# Altium project Phaser.PrjPCB (part 9 of 9)
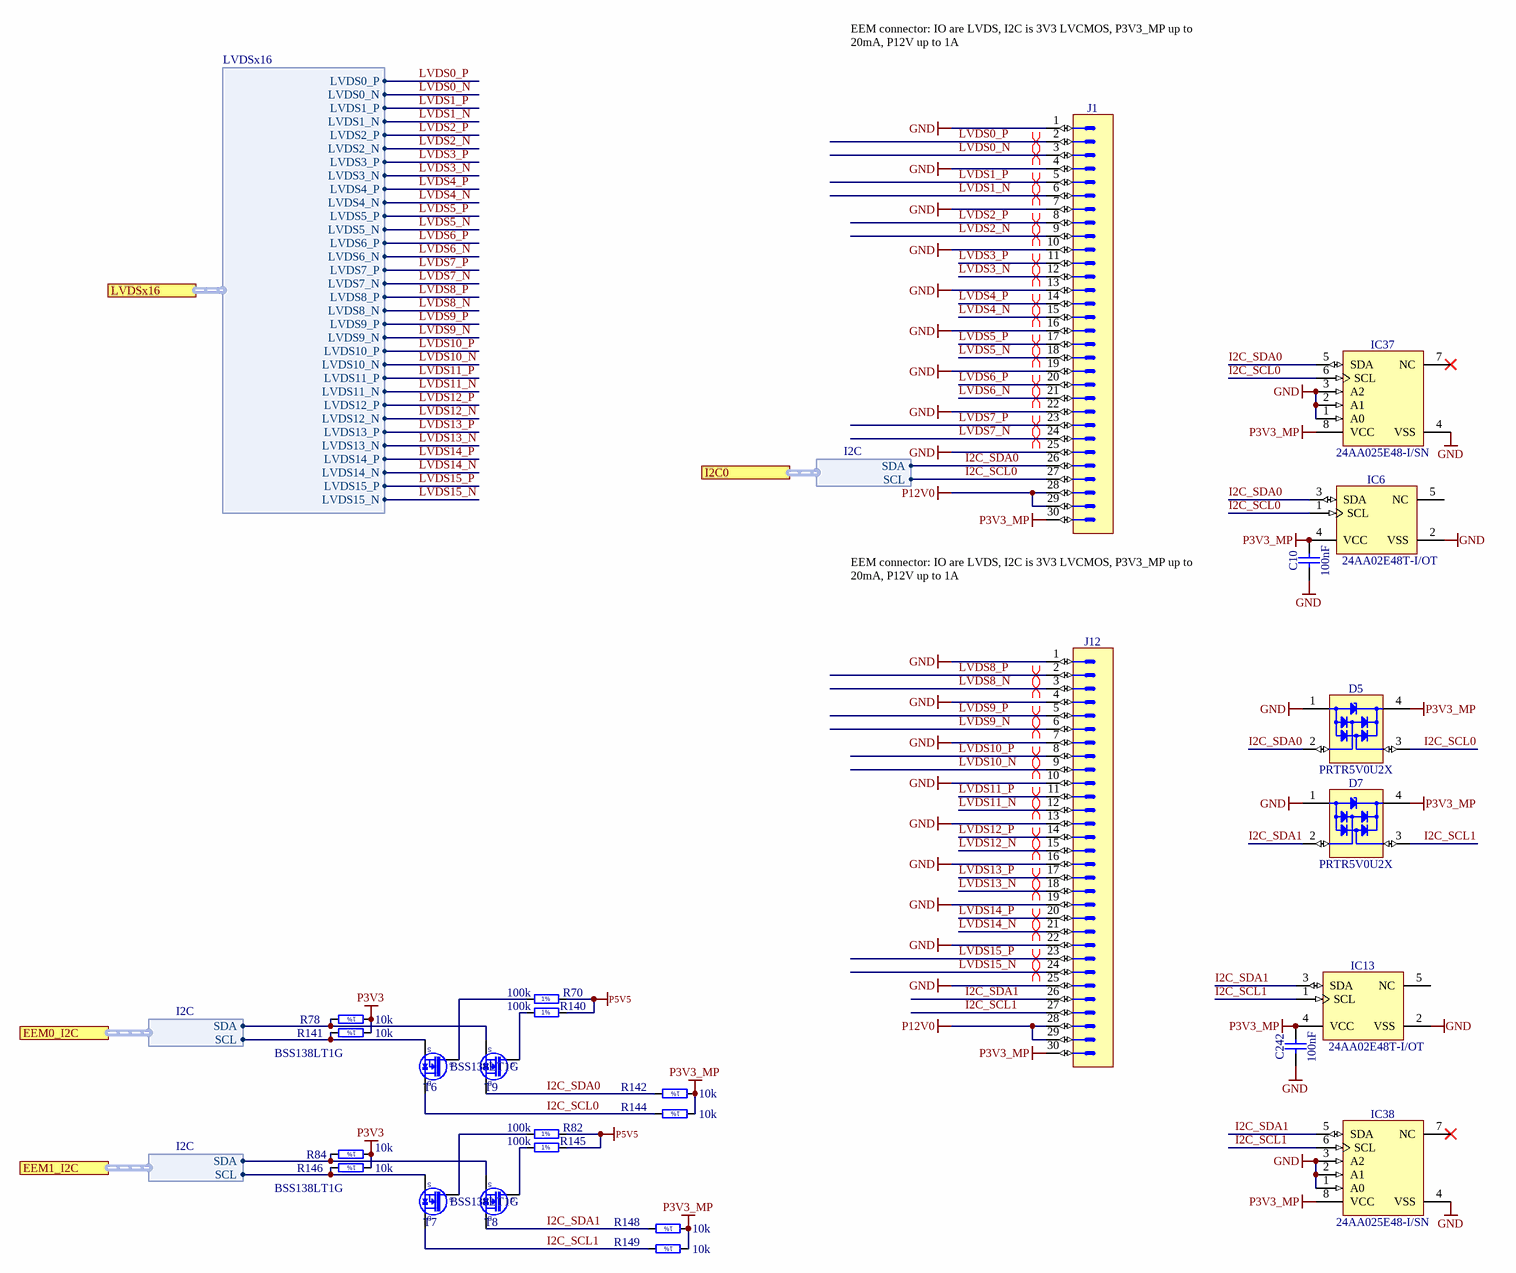
[diagram p117: LVDS_IFC.SchDoc]

## Nets that join several sheets
GND: Phaser (34 pins), Attenuator0 (28 pins), Attenuator1 (28 pins), PWR_Supply (52 pins), CLK_INPUT (7 pins), ADC_2CH (29 pins), U_Input_channel (17 pins), DAC (36 pins), FPGA_CFG_EEM (R43.1), U_Input_channel (17 pins), FPGA_SUP_CFG (181 pins), FPGA_GTP (16 pins), FPGA_SDRAM (46 pins), CFG_FLASH_Update (11 pins), U_Upconversion (53 pins), U_Upconversion (53 pins), DAC_SUPPLY (114 pins), PWR_Supply-5.5V (95 pins), LVDS_IFC (32 pins)
MGTAVTT: FPGA_SUP_CFG (14 pins), FPGA_GTP (R191.1)
N11V5A: PWR_Supply (6 pins), U_Input_channel (8 pins), U_Input_channel (8 pins)
P1V0: PWR_Supply (R182.2 TP13.1), FPGA_SUP_CFG (31 pins), PWR_Supply-5.5V (C260.2 L42.2 R131.1 R155.2)
P1V2: PWR_Supply (R183.2 TP14.1), FPGA_SUP_CFG (L18.1), PWR_Supply-5.5V (C338.2 IC28.1)
P1V2A: PWR_Supply (R205.2 TP1.1), DAC_SUPPLY (24 pins), PWR_Supply-5.5V (6 pins)
P1V2D: DAC_SUPPLY (22 pins), PWR_Supply-5.5V (6 pins)
P1V5: PWR_Supply (R208.2 TP3.1), FPGA_SUP_CFG (14 pins), FPGA_SDRAM (29 pins), PWR_Supply-5.5V (7 pins)
P1V8: PWR_Supply (R210.2 TP10.1), FPGA_SUP_CFG (C232.2 L4.1 L26.1), PWR_Supply-5.5V (C336.2 L50.2 R166.2)
P1V8A: CLK_INPUT (L10.2), PWR_Supply-5.5V (C340.2 IC35.5)
P2V5: Phaser (R235.2 R236.2), PWR_Supply (R211.2 TP4.1), ADC_2CH (C55.2 IC24.1 L8.2), FPGA_CFG_EEM (R42.2), FPGA_SUP_CFG (53 pins), FPGA_GTP (C238.2 OSC2.2 OSC2.6), CFG_FLASH_Update (10 pins), DAC_SUPPLY (L7.2), PWR_Supply-5.5V (C361.2 IC29.4)
P3V3: Phaser (R29.1 R64.1 R259.1 R260.1), PWR_Supply (5 pins), CLK_INPUT (LD7.2), DAC (R231.2), FPGA_SUP_CFG (13 pins), FPGA_SDRAM (C172.2 IC9.7 IC9.10 R127.2), CFG_FLASH_Update (IC27.2), PWR_Supply-5.5V (9 pins), LVDS_IFC (R78.1 R84.1 R141.1 R146.1)
P3V3_MP: PWR_Supply (R212.2 TP5.1), PWR_Supply-5.5V (9 pins), LVDS_IFC (14 pins)
P3V3A: PWR_Supply (R213.2 TP6.1), U_Upconversion (7 pins), U_Upconversion (7 pins), DAC_SUPPLY (L14.2 L17.2 L41.2), PWR_Supply-5.5V (6 pins)
P3V6: PWR_Supply (R215.2 TP15.1), PWR_Supply-5.5V (C348.2 L48.2 L51.1 R200.2)
P5V0A: Attenuator0 (L16A.1), Attenuator1 (L16B.1), PWR_Supply (R216.2 TP16.1), ADC_2CH (8 pins), U_Upconversion (L34A.1 L35A.2), U_Upconversion (L34B.1 L35B.2), PWR_Supply-5.5V (C155.2 C266.2 IC21.4 R130.2)
P5V5: PWR_Supply (R217.2 TP8.1), PWR_Supply-5.5V (33 pins), LVDS_IFC (R70.2 R82.2 R140.2 R145.2)
P11V5A: PWR_Supply (6 pins), U_Input_channel (7 pins), U_Input_channel (7 pins)
P12V0: PWR_Supply (12 pins), PWR_Supply-5.5V (7 pins), LVDS_IFC (J1.28 J1.29 J12.28 J12.29)
REF_P1V7066: ADC_2CH (IC12.7 R7.2 RN1.7), U_Input_channel (R72A.1 RN4A.5 RN4A.8), U_Input_channel (R72B.1 RN4B.5 RN4B.8)
REF_P2V048: ADC_2CH (IC12.1 RN1.3 RN2.6), U_Input_channel (R138A.1), U_Input_channel (R138B.1)
ADC_CLKOUT_N: ADC_2CH (IC1.18), FPGA_ADC_DAC (IC4#1.K19)
ADC_CLKOUT_P: ADC_2CH (IC1.17), FPGA_ADC_DAC (IC4#1.K18)
ADC_CNVn_N: ADC_2CH (IC24.4 R55.1), FPGA_ADC_DAC (IC4#1.J22)
ADC_CNVn_P: ADC_2CH (IC24.3 R55.2), FPGA_ADC_DAC (IC4#1.H22)
ADC_SCK_N: ADC_2CH (IC1.22 R5.1), FPGA_ADC_DAC (IC4#1.N22)
ADC_SCK_P: ADC_2CH (IC1.21 R5.2), FPGA_ADC_DAC (IC4#1.M22)
ADC_SDOA_N: ADC_2CH (IC1.16), FPGA_ADC_DAC (IC4#1.K22)
ADC_SDOA_P: ADC_2CH (IC1.15), FPGA_ADC_DAC (IC4#1.K21)
ADC_SDOB_N: ADC_2CH (IC1.20), FPGA_ADC_DAC (IC4#1.M21)
ADC_SDOB_P: ADC_2CH (IC1.19), FPGA_ADC_DAC (IC4#1.L21)
ASSY_Variant: Phaser (R236.1 R244.2), FPGA_ADC_DAC (IC4#1.N19)
ATT_CLK0: Attenuator0 (IC3A.21), FPGA_MISC (IC4#1.R4)
ATT_CLK1: Attenuator1 (IC3B.21), FPGA_MISC (IC4#1.T6)
ATT_LE0: Attenuator0 (IC3A.22), FPGA_MISC (IC4#1.R3)
ATT_LE1: Attenuator1 (IC3B.22), FPGA_MISC (IC4#1.R6)
ATT_RST0n: Attenuator0 (IC3A.20), FPGA_MISC (IC4#1.T4)
ATT_RST1n: Attenuator1 (IC3B.20), FPGA_MISC (IC4#1.V3)
ATT_S_IN0: Attenuator0 (IC3A.24), FPGA_MISC (IC4#1.R2)
ATT_S_IN1: Attenuator1 (IC3B.24), FPGA_MISC (IC4#1.U5)
ATT_S_OUT0: Phaser (R170.1), FPGA_MISC (IC4#1.T5)
ATT_S_OUT1: Phaser (R147.1), FPGA_MISC (IC4#1.V4)
BBI_N: DAC (C383.2 R17.1), U_Upconversion (IC2B.28 L29B.1 R49B.1)
BBI_N: DAC (C387.2 R69.1), U_Upconversion (IC2A.28 L29A.1 R49A.1)
BBI_P: DAC (C382.2 R3.1), U_Upconversion (IC2B.27 L31B.1 R49B.2)
BBI_P: DAC (C386.2 R68.1), U_Upconversion (IC2A.27 L31A.1 R49A.2)
BBQ_N: DAC (C385.2 R228.1), U_Upconversion (IC2B.9 L33B.1 R71B.2)
BBQ_N: DAC (C389.2 R230.1), U_Upconversion (IC2A.9 L33A.1 R71A.2)
BBQ_P: DAC (C384.2 R227.1), U_Upconversion (IC2B.10 L38B.1 R71B.1)
BBQ_P: DAC (C388.2 R229.1), U_Upconversion (IC2A.10 L38A.1 R71A.1)
CFG_CCLK: FPGA_SUP_CFG (IC4#1.L12), CFG_FLASH_Update (IC17.2 IC27.16)
CFG_D02: FPGA_CFG_EEM (IC4#1.P21), CFG_FLASH_Update (IC27.9 R96.1)
CFG_D03: FPGA_CFG_EEM (IC4#1.R21), CFG_FLASH_Update (IC27.1 R94.1)
CFG_DIN: FPGA_CFG_EEM (IC4#1.R22), CFG_FLASH_Update (IC17.9 IC27.8)
CFG_FCS: FPGA_CFG_EEM (IC4#1.T19), CFG_FLASH_Update (IC17.10 IC27.7 R95.1)
CFG_MOSI: FPGA_CFG_EEM (IC4#1.P22), CFG_FLASH_Update (IC17.3 IC27.15)
CH0_GAIN_A0: FPGA_MISC (IC4#1.AB5), U_Input_channel (IC16A.4)
CH0_GAIN_A1: FPGA_MISC (IC4#1.AA5), U_Input_channel (IC16A.5)
CH1_GAIN_A0: FPGA_MISC (IC4#1.AA6), U_Input_channel (IC16B.4)
CH1_GAIN_A1: FPGA_MISC (IC4#1.AB6), U_Input_channel (IC16B.5)
CK_GTP_N: CLK_INPUT (C26.2), FPGA_GTP (IC4#2.E6)
CK_GTP_P: CLK_INPUT (C27.2), FPGA_GTP (IC4#2.F6)
CPCIS_CLK_N: CLK_INPUT (C362.1), FPGA_GTP (J9.17)
CPCIS_CLK_P: CLK_INPUT (C359.1), FPGA_GTP (J9.15)
DAC_ALARM: FPGA_MISC (IC4#1.AB8), DAC (U1.N12)
DAC_CLK_N: CLK_INPUT (C3.2), DAC (R88.2 U1.A11)
DAC_CLK_P: CLK_INPUT (C4.2), DAC (R88.1 U1.A12)
DAC_RESETB: FPGA_MISC (IC4#1.Y7), DAC (R36.1 U1.N10)
DAC_SCLK: FPGA_MISC (IC4#1.U7), DAC (B9.1 U1.P9)
DAC_SDENB: FPGA_MISC (IC4#1.Y9), DAC (B12.1 U1.P10)
DAC_SDIO: FPGA_MISC (IC4#1.W9), DAC (B10.1 U1.P11)
DAC_SDO: FPGA_MISC (IC4#1.AA8), DAC (B11.1 U1.P12)
DAC_SLEEP: FPGA_MISC (IC4#1.Y8), DAC (R231.1 U1.N11)
DAC_TXENA: FPGA_MISC (IC4#1.V8), DAC (B13.1 U1.N9)
DATA_CLK_N: DAC (U1.G1), FPGA_ADC_DAC (IC4#1.D22)
DATA_CLK_P: DAC (U1.G2), FPGA_ADC_DAC (IC4#1.E22)
EEM0_I2C_SCL: FPGA_MISC (IC4#1.AB1), CFG_FLASH_Update (IC10.8), LVDS_IFC (R141.2 T6.2)
EEM0_I2C_SDA: FPGA_MISC (IC4#1.AA1), CFG_FLASH_Update (IC10.7), LVDS_IFC (R78.2 T9.2)
EEM1_I2C_SCL: FPGA_MISC (IC4#1.Y2), LVDS_IFC (R146.2 T7.2)
EEM1_I2C_SDA: FPGA_MISC (IC4#1.Y3), LVDS_IFC (R84.2 T8.2)
FAN_PWM: FPGA_MISC (IC4#1.AB7), PWR_Supply (C368.2)
FAN_TACHO: FPGA_MISC (IC4#1.AB2), PWR_Supply (R277.1)
FPGA_DONE: FPGA_SUP_CFG (IC4#1.G11 R57.1 T4.1), CFG_FLASH_Update (R187.1)
FPGA_INIT_B: FPGA_SUP_CFG (IC4#1.U12 R93.1), CFG_FLASH_Update (T15.3)
FPGA_PROGRAM_B: FPGA_SUP_CFG (IC4#1.N12 R233.1), CFG_FLASH_Update (T1.3)
HW_REV0: Phaser (R261.1), FPGA_ADC_DAC (IC4#1.N18)
HW_REV1: Phaser (R235.1), FPGA_ADC_DAC (IC4#1.M17)
HW_REV2: Phaser (R242.1), FPGA_ADC_DAC (IC4#1.M15)
HW_REV3: Phaser (R243.1), FPGA_ADC_DAC (IC4#1.M16)
I2C_SCL0: PWR_Supply-5.5V (R175.1), LVDS_IFC (6 pins)
I2C_SDA0: PWR_Supply-5.5V (R179.1), LVDS_IFC (6 pins)
IN_0_N: ADC_2CH (IC1.2), U_Input_channel (C224A.2 C226A.2 R97A.2)
IN_0_P: ADC_2CH (IC1.3), U_Input_channel (C226A.1 C227A.1 R58A.2)
IN_1_N: ADC_2CH (IC1.7), U_Input_channel (C226B.1 C227B.1 R58B.2)
IN_1_P: ADC_2CH (IC1.6), U_Input_channel (C224B.2 C226B.2 R97B.2)
ISTR_PARITYAB_N: DAC (U1.H1), FPGA_ADC_DAC (IC4#1.G22)
ISTR_PARITYAB_P: DAC (U1.H2), FPGA_ADC_DAC (IC4#1.G21)
LED0: Phaser (R28.1), FPGA_MISC (IC4#1.V5)
LED1: Phaser (R30.1), FPGA_MISC (IC4#1.U6)
LED2: Phaser (R152.1), FPGA_MISC (IC4#1.AA3)
LED3: Phaser (R234.1), FPGA_MISC (IC4#1.W4)
LED4: Phaser (R153.1), FPGA_MISC (IC4#1.AA4)
LED5: Phaser (R26.1), FPGA_MISC (IC4#1.W5)
LVDS0_N: FPGA_CFG_EEM (IC4#1.W20), LVDS_IFC (J1.3)
LVDS0_P: FPGA_CFG_EEM (IC4#1.W19), LVDS_IFC (J1.2)
LVDS1_N: FPGA_CFG_EEM (IC4#1.U21), LVDS_IFC (J1.6)
LVDS1_P: FPGA_CFG_EEM (IC4#1.T21), LVDS_IFC (J1.5)
LVDS2_N: FPGA_CFG_EEM (IC4#1.W22), LVDS_IFC (J1.9)
LVDS2_P: FPGA_CFG_EEM (IC4#1.W21), LVDS_IFC (J1.8)
LVDS3_N: FPGA_CFG_EEM (IC4#1.T18), LVDS_IFC (J1.12)
LVDS3_P: FPGA_CFG_EEM (IC4#1.R18), LVDS_IFC (J1.11)
LVDS4_N: FPGA_CFG_EEM (IC4#1.V20), LVDS_IFC (J1.15)
LVDS4_P: FPGA_CFG_EEM (IC4#1.U20), LVDS_IFC (J1.14)
LVDS5_N: FPGA_CFG_EEM (IC4#1.R19), LVDS_IFC (J1.18)
LVDS5_P: FPGA_CFG_EEM (IC4#1.P19), LVDS_IFC (J1.17)
LVDS6_N: FPGA_CFG_EEM (IC4#1.V19), LVDS_IFC (J1.21)
LVDS6_P: FPGA_CFG_EEM (IC4#1.V18), LVDS_IFC (J1.20)
LVDS7_N: FPGA_CFG_EEM (IC4#1.W17), LVDS_IFC (J1.24)
LVDS7_P: FPGA_CFG_EEM (IC4#1.V17), LVDS_IFC (J1.23)
LVDS8_N: FPGA_CFG_EEM (IC4#1.Y19), LVDS_IFC (J12.3)
LVDS8_P: FPGA_CFG_EEM (IC4#1.Y18), LVDS_IFC (J12.2)
LVDS9_N: FPGA_CFG_EEM (IC4#1.AB20), LVDS_IFC (J12.6)
LVDS9_P: FPGA_CFG_EEM (IC4#1.AA19), LVDS_IFC (J12.5)
LVDS10_N: FPGA_CFG_EEM (IC4#1.AA21), LVDS_IFC (J12.9)
LVDS10_P: FPGA_CFG_EEM (IC4#1.AA20), LVDS_IFC (J12.8)
LVDS11_N: FPGA_CFG_EEM (IC4#1.AB18), LVDS_IFC (J12.12)
LVDS11_P: FPGA_CFG_EEM (IC4#1.AA18), LVDS_IFC (J12.11)
LVDS12_N: FPGA_CFG_EEM (IC4#1.AB22), LVDS_IFC (J12.15)
LVDS12_P: FPGA_CFG_EEM (IC4#1.AB21), LVDS_IFC (J12.14)
LVDS13_N: FPGA_CFG_EEM (IC4#1.Y22), LVDS_IFC (J12.18)
LVDS13_P: FPGA_CFG_EEM (IC4#1.Y21), LVDS_IFC (J12.17)
LVDS14_N: FPGA_CFG_EEM (IC4#1.U18), LVDS_IFC (J12.21)
LVDS14_P: FPGA_CFG_EEM (IC4#1.U17), LVDS_IFC (J12.20)
LVDS15_N: FPGA_CFG_EEM (IC4#1.R14), LVDS_IFC (J12.24)
LVDS15_P: FPGA_CFG_EEM (IC4#1.P14), LVDS_IFC (J12.23)
LVDSA0_N: DAC (U1.G3), FPGA_ADC_DAC (IC4#1.F20)
LVDSA0_P: DAC (U1.G4), FPGA_ADC_DAC (IC4#1.F19)
LVDSA1_N: DAC (U1.F1), FPGA_ADC_DAC (IC4#1.D19)
LVDSA1_P: DAC (U1.F2), FPGA_ADC_DAC (IC4#1.E19)
LVDSA2_N: DAC (U1.F3), FPGA_ADC_DAC (IC4#1.E18)
LVDSA2_P: DAC (U1.F4), FPGA_ADC_DAC (IC4#1.F18)
LVDSA3_N: DAC (U1.E1), FPGA_ADC_DAC (IC4#1.C22)
LVDSA3_P: DAC (U1.E2), FPGA_ADC_DAC (IC4#1.B22)
LVDSA4_N: DAC (U1.E3), FPGA_ADC_DAC (IC4#1.C17)
LVDSA4_P: DAC (U1.E4), FPGA_ADC_DAC (IC4#1.D17)
LVDSA5_N: DAC (U1.D1), FPGA_ADC_DAC (IC4#1.A19)
LVDSA5_P: DAC (U1.D2), FPGA_ADC_DAC (IC4#1.A18)
LVDSA6_N: DAC (U1.D3), FPGA_ADC_DAC (IC4#1.E17)
LVDSA6_P: DAC (U1.D4), FPGA_ADC_DAC (IC4#1.F16)
LVDSA7_N: DAC (U1.C1), FPGA_ADC_DAC (IC4#1.D21)
LVDSA7_P: DAC (U1.C2), FPGA_ADC_DAC (IC4#1.E21)
LVDSA8_N: DAC (U1.C3), FPGA_ADC_DAC (IC4#1.D16)
LVDSA8_P: DAC (U1.C4), FPGA_ADC_DAC (IC4#1.E16)
LVDSA9_N: DAC (U1.B1), FPGA_ADC_DAC (IC4#1.C19)
LVDSA9_P: DAC (U1.A1), FPGA_ADC_DAC (IC4#1.C18)
LVDSA10_N: DAC (U1.B2), FPGA_ADC_DAC (IC4#1.B18)
LVDSA10_P: DAC (U1.A2), FPGA_ADC_DAC (IC4#1.B17)
LVDSA11_N: DAC (U1.B3), FPGA_ADC_DAC (IC4#1.D15)
LVDSA11_P: DAC (U1.A3), FPGA_ADC_DAC (IC4#1.D14)
LVDSA12_N: DAC (U1.B4), FPGA_ADC_DAC (IC4#1.E14)
LVDSA12_P: DAC (U1.A4), FPGA_ADC_DAC (IC4#1.E13)
LVDSA13_N: DAC (U1.B5), FPGA_ADC_DAC (IC4#1.F14)
LVDSA13_P: DAC (U1.A5), FPGA_ADC_DAC (IC4#1.F13)
LVDSA14_N: DAC (U1.B6), FPGA_ADC_DAC (IC4#1.B16)
LVDSA14_P: DAC (U1.A6), FPGA_ADC_DAC (IC4#1.B15)
LVDSA15_N: DAC (U1.B7), FPGA_ADC_DAC (IC4#1.C15)
LVDSA15_P: DAC (U1.A7), FPGA_ADC_DAC (IC4#1.C14)
LVDSB0_N: DAC (U1.P7), FPGA_ADC_DAC (IC4#1.G16)
LVDSB0_P: DAC (U1.N7), FPGA_ADC_DAC (IC4#1.G15)
LVDSB1_N: DAC (U1.P6), FPGA_ADC_DAC (IC4#1.M20)
LVDSB1_P: DAC (U1.N6), FPGA_ADC_DAC (IC4#1.N20)
LVDSB2_N: DAC (U1.P5), FPGA_ADC_DAC (IC4#1.G20)
LVDSB2_P: DAC (U1.N5), FPGA_ADC_DAC (IC4#1.H20)
LVDSB3_N: DAC (U1.P4), FPGA_ADC_DAC (IC4#1.H19)
LVDSB3_P: DAC (U1.N4), FPGA_ADC_DAC (IC4#1.J19)
LVDSB4_N: DAC (U1.P3), FPGA_ADC_DAC (IC4#1.H18)
LVDSB4_P: DAC (U1.N3), FPGA_ADC_DAC (IC4#1.H17)
LVDSB5_N: DAC (U1.P2), FPGA_ADC_DAC (IC4#1.L18)
LVDSB5_P: DAC (U1.N2), FPGA_ADC_DAC (IC4#1.M18)
LVDSB6_N: DAC (U1.P1), FPGA_ADC_DAC (IC4#1.J21)
LVDSB6_P: DAC (U1.N1), FPGA_ADC_DAC (IC4#1.J20)
LVDSB7_N: DAC (U1.M1), FPGA_ADC_DAC (IC4#1.H15)
LVDSB7_P: DAC (U1.M2), FPGA_ADC_DAC (IC4#1.J15)
LVDSB8_N: DAC (U1.M3), FPGA_ADC_DAC (IC4#1.L16)
LVDSB8_P: DAC (U1.M4), FPGA_ADC_DAC (IC4#1.K16)
LVDSB9_N: DAC (U1.L1), FPGA_ADC_DAC (IC4#1.L15)
LVDSB9_P: DAC (U1.L2), FPGA_ADC_DAC (IC4#1.L14)
LVDSB10_N: DAC (U1.L3), FPGA_ADC_DAC (IC4#1.K14)
LVDSB10_P: DAC (U1.L4), FPGA_ADC_DAC (IC4#1.K13)
LVDSB11_N: DAC (U1.K1), FPGA_ADC_DAC (IC4#1.J17)
LVDSB11_P: DAC (U1.K2), FPGA_ADC_DAC (IC4#1.K17)
LVDSB12_N: DAC (U1.K3), FPGA_ADC_DAC (IC4#1.H14)
LVDSB12_P: DAC (U1.K4), FPGA_ADC_DAC (IC4#1.J14)
LVDSB13_N: DAC (U1.J1), FPGA_ADC_DAC (IC4#1.L20)
LVDSB13_P: DAC (U1.J2), FPGA_ADC_DAC (IC4#1.L19)
LVDSB14_N: DAC (U1.J3), FPGA_ADC_DAC (IC4#1.G13)
LVDSB14_P: DAC (U1.J4), FPGA_ADC_DAC (IC4#1.H13)
LVDSB15_N: DAC (U1.H3), FPGA_ADC_DAC (IC4#1.L13)
LVDSB15_P: DAC (U1.H4), FPGA_ADC_DAC (IC4#1.M13)
NetC133A_1: Phaser (J16.1), U_Upconversion (C133A.1 R226A.1)
NetC133B_1: Phaser (IC34.2 R257.1), U_Upconversion (C133B.1 R226B.1)
NetC190_1: Phaser (J7.1), CLK_INPUT (C190.1)
NetC196_1: Phaser (J2.1), CLK_INPUT (C196.1)
NetC270A_2: Attenuator0 (C270A.2), DAC (R252.1)
NetC270B_2: Attenuator1 (C270B.2), DAC (R249.1)
NetC354A_1: Phaser (IC34.1 R257.2), U_Upconversion (C354A.1)
NetC354B_1: Phaser (J17.1), U_Upconversion (C354B.1)
NetC369A_1: Attenuator0 (C369A.1), U_Upconversion (IC2A.18)
NetC369B_1: Attenuator1 (C369B.1), U_Upconversion (IC2B.18)
NetIC3A_19: Phaser (R170.2), Attenuator0 (IC3A.19)
NetIC3B_19: Phaser (R147.2), Attenuator1 (IC3B.19)
NetIC7_3: PWR_Supply (IC7.3 IC18.3), PWR_Supply-5.5V (R60.1 R87.1 R130.1)
NetJ3_1: Phaser (J3.1), U_Input_channel (L2A.1 R8A.1 R83A.2)
NetJ4_1: Phaser (J4.1), U_Input_channel (L2B.2 R98B.1 SW1B.1)
NetJ7_2: Phaser (J7.2), CLK_INPUT (R27.2 R45.1 TR1.6)
NetR60_2: ADC_2CH (R90.2), PWR_Supply-5.5V (R60.2)
OSTR_N: DAC (C360.1), FPGA_ADC_DAC (IC4#1.B13)
OSTR_P: DAC (C363.1), FPGA_ADC_DAC (IC4#1.C13)
PARITYCD_N: DAC (U1.P8), FPGA_ADC_DAC (IC4#1.G18)
PARITYCD_P: DAC (U1.N8), FPGA_ADC_DAC (IC4#1.G17)
RF_OUT0: Phaser (J5.1), Attenuator0 (C272A.1 C370A.2)
RF_OUT1: Phaser (J6.1), Attenuator1 (C272B.1 C370B.2)
SG0: Phaser (C37.1 J2.2 R14.2 R150.2), CLK_INPUT (R81.2 R245.1 TR2.6)
SG1: Phaser (C11.1 J3.2 R156.2), U_Input_channel (L2A.2 R98A.1 SW1A.1)
SG2: Phaser (C31.1 J4.2 R157.2), U_Input_channel (L2B.1 R8B.1 R83B.2)
SMA_CLK_SEL: CLK_INPUT (R165.1 T5.1), FPGA_CFG_EEM (IC4#1.T20)
SYNC_N: DAC (U1.B8), FPGA_ADC_DAC (IC4#1.A14)
SYNC_P: DAC (U1.A8), FPGA_ADC_DAC (IC4#1.A13)
TERM_STAT0: Phaser (R29.2 T13.1), FPGA_MISC (IC4#1.W6), U_Input_channel (SW1A.2)
TERM_STAT1: Phaser (R259.2 T2.1), FPGA_MISC (IC4#1.Y6), U_Input_channel (SW1B.2)
TRF0_CLK: FPGA_MISC (IC4#1.U3), U_Upconversion (B16A.1 IC2A.47)
TRF0_DATA: FPGA_MISC (IC4#1.T3), U_Upconversion (B15A.1 IC2A.46)
TRF0_LD: FPGA_MISC (IC4#1.U2), U_Upconversion (B17A.1 IC2A.5)
TRF0_LE: FPGA_MISC (IC4#1.T1), U_Upconversion (B14A.1 IC2A.45)
TRF0_PS: FPGA_MISC (IC4#1.U1), U_Upconversion (B19A.1 IC2A.1)
TRF0_RDBK: FPGA_MISC (IC4#1.V9), U_Upconversion (B18A.1 IC2A.2)
TRF1_CLK: FPGA_MISC (IC4#1.Y1), U_Upconversion (B16B.1 IC2B.47)
TRF1_DATA: FPGA_MISC (IC4#1.W1), U_Upconversion (B15B.1 IC2B.46)
TRF1_LD: FPGA_MISC (IC4#1.V2), U_Upconversion (B17B.1 IC2B.5)
TRF1_LE: FPGA_MISC (IC4#1.W2), U_Upconversion (B14B.1 IC2B.45)
TRF1_PS: FPGA_MISC (IC4#1.W7), U_Upconversion (B19B.1 IC2B.1)
TRF1_RDBK: FPGA_MISC (IC4#1.V7), U_Upconversion (B18B.1 IC2B.2)
UPC_REF_CLK_N: CLK_INPUT (C12.2), U_Upconversion (C281B.1 TR6B.1)
UPC_REF_CLK_N: CLK_INPUT (C5.2), U_Upconversion (C281A.1 TR6A.1)
UPC_REF_CLK_P: CLK_INPUT (C13.2), U_Upconversion (C280B.2 TR6B.3)
UPC_REF_CLK_P: CLK_INPUT (C9.2), U_Upconversion (C280A.2 TR6A.3)

## Assembly variants
Baseband: not fitted C11 C30A C30B C31 C32 C37 C43A C43B C44A C44B C45A C45B C46A C46B C126A C126B C127A C127B C128A C128B C129A C129B C130A C130B C133A C133B C134A C134B C146 C153A C153B C154A C154B C246A C246B C280A C280B C281A C281B C282A C282B C283A C283B C284A C284B C285A C285B C286A C286B C287A C287B C288A C288B C289A C289B C354A C354B C355A C355B C356A C356B C357A C357B C358A C358B C359 C362 C369A C369B C370A C370B C371A C371B C372A C372B C373A C373B C374A C374B C375A C375B C376A C376B C377A C377B C382 C383 C384 C385 C386 C387 C388 C389 HS3A HS3B IC2A IC2B IC34 J9 J14A J14B J16 J17 L19A L19B L20A L20B L22A L22B L24A L24B L25A L25B L27A L27B L29A L29B L31A L31B L33A L33B L34A L34B L35A L35B L38A L38B L52A L52B R2 R3 R8A R8B R11 R12 R13 R14 R15 R16 R17 R21 R24 R27 R31 R32 R37 R38A R38B R39 R40 R41A R41B R42 R45 R46 R47 R49A R49B R50 R52 R54 R59 R61 R62 R63 R66 R67 R68 R69 R71A R71B R73 R76 R77 R81 R85 R86 R98A R98B R150 R156 R157 R193A R193B R194A R194B R195A R195B R196A R196B R224A R224B R225A R225B R226A R226B R227 R228 R229 R230 R231 R232 R244 R245 R257 TR6A TR6B TR7 TR9 TR10 TR11
Upconverter: not fitted C11 C14A C14B C15A C15B C16A C16B C31 C32 C37 C146 C270A C270B C272A C272B C273A C273B C274A C274B C275A C275B C276A C276B C359 C362 IC34 J9 J13 J15 L29A L29B L31A L31B L33A L33B L38A L38B R2 R3 R8A R8B R11 R12 R13 R14 R15 R16 R17 R21 R24 R27 R31 R32 R37 R38A R38B R39 R40 R41A R41B R42 R45 R46 R47 R50 R52 R54 R59 R61 R62 R63 R66 R67 R68 R69 R73 R76 R77 R81 R85 R86 R98A R98B R150 R156 R157 R227 R228 R229 R230 R231 R232 R236 R245 R246 R247 R249 R250 R251 R252 R253 R254 TR3 TR4 TR5 TR8